# EAGLE design HackJrGameController-v1.0 (EAGLE 6.5.0)
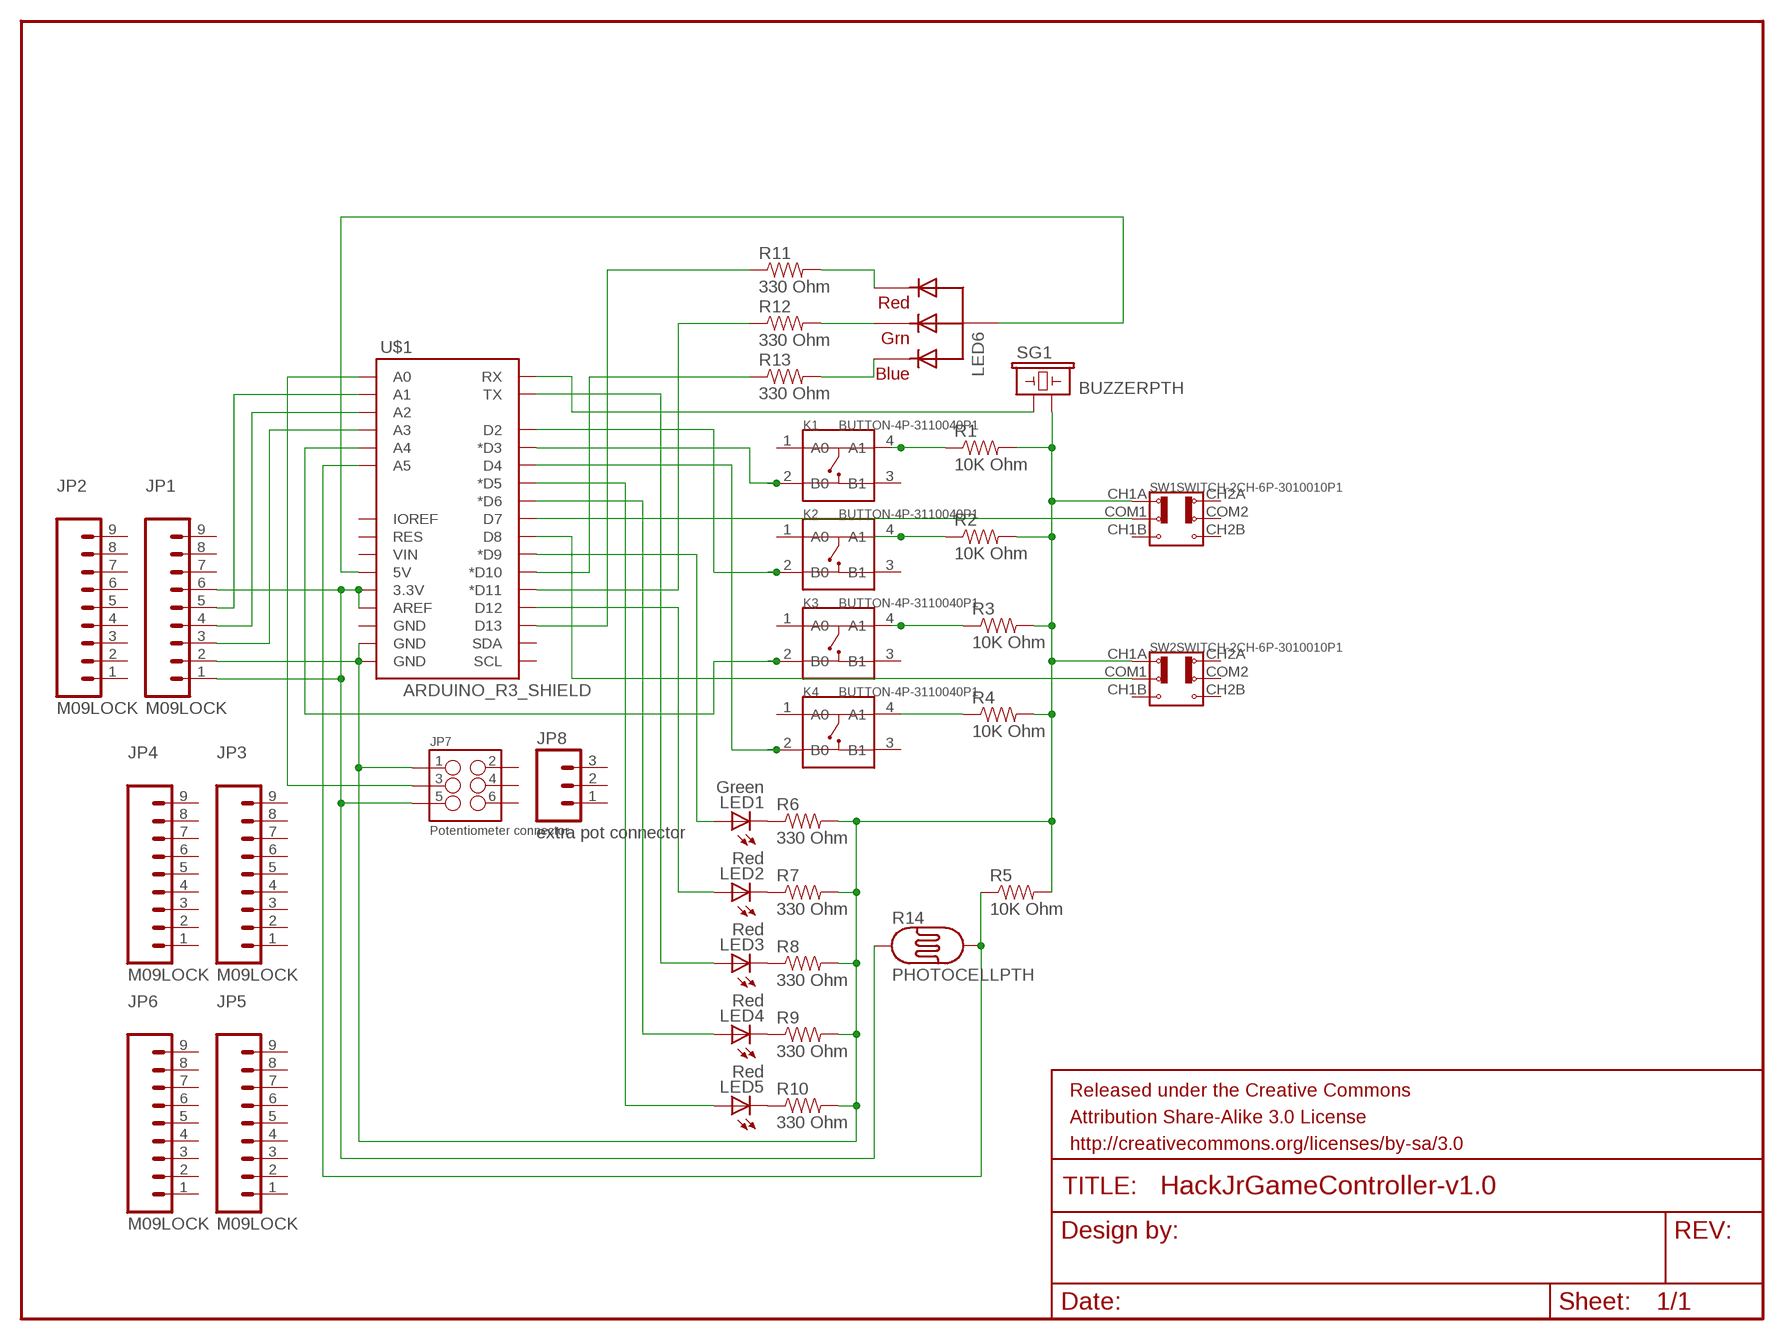
[diagram p0: schematic, sheet 1]

## Parts
FRAME1  FRAME-LETTER  [CREATIVE_COMMONS]
JP1  M09LOCK  [1X09_LOCK]
JP2  M09LOCK  [1X09_LOCK]
JP3  M09LOCK  [1X09_LOCK]
JP4  M09LOCK  [1X09_LOCK]
JP5  M09LOCK  [1X09_LOCK]
JP6  M09LOCK  [1X09_LOCK]
JP7  Potentiometer connector  M03X2NO_SILK  [2X3-NS]
JP8  extra pot connector  M031X03_NO_SILK  [1X03_NO_SILK]
K1  BUTTON-4P-3110040P1  [4P-6.0X6.0X5.0H]
K2  BUTTON-4P-3110040P1  [4P-6.0X6.0X5.0H]
K3  BUTTON-4P-3110040P1  [4P-6.0X6.0X5.0H]
K4  BUTTON-4P-3110040P1  [4P-6.0X6.0X5.0H]
LED1  Green  LED5MM  [LED5MM]
LED2  Red  LED5MM  [LED5MM]
LED3  Red  LED5MM  [LED5MM]
LED4  Red  LED5MM  [LED5MM]
LED5  Red  LED5MM  [LED5MM]
LED6  RGBLED_CA-5MM  [LED5MMRGB]
R1  10K Ohm  10KOHM1/6W5%(PTH)KIT  [AXIAL-0.3-KIT]
R2  10K Ohm  10KOHM1/6W5%(PTH)KIT  [AXIAL-0.3-KIT]
R3  10K Ohm  10KOHM1/6W5%(PTH)KIT  [AXIAL-0.3-KIT]
R4  10K Ohm  10KOHM1/6W5%(PTH)KIT  [AXIAL-0.3-KIT]
R5  10K Ohm  10KOHM1/6W5%(PTH)KIT  [AXIAL-0.3-KIT]
R6  330 Ohm  RESISTORKIT  [AXIAL-0.3-KIT]
R7  330 Ohm  RESISTORKIT  [AXIAL-0.3-KIT]
R8  330 Ohm  RESISTORKIT  [AXIAL-0.3-KIT]
R9  330 Ohm  RESISTORKIT  [AXIAL-0.3-KIT]
R10  330 Ohm  RESISTORKIT  [AXIAL-0.3-KIT]
R11  330 Ohm  RESISTORKIT  [AXIAL-0.3-KIT]
R12  330 Ohm  RESISTORKIT  [AXIAL-0.3-KIT]
R13  330 Ohm  RESISTORKIT  [AXIAL-0.3-KIT]
R14  PHOTOCELLPTH  [PHOTOCELL]
SG1  BUZZERPTH  [BUZZER-12MM]
SW1  SWITCH-2CH-6P-3010010P1  [6P-2CH-2.54-9.1X3.5X3.2+2H]
SW2  SWITCH-2CH-6P-3010010P1  [6P-2CH-2.54-9.1X3.5X3.2+2H]
U$1  ARDUINO_R3_SHIELD  [UNO_R3_SHIELD]

## Nets
N$1: LED6.2(VCC) U$1.5V
N$2: JP1.2 JP7.1 R1.P$2 R2.P$2 R3.P$2 R4.P$2 R5.P$2 R6.P$2 R7.P$2 R8.P$2 R9.P$2 R10.P$2 SG1.- SW1.CH1A SW2.CH1A U$1.GND@0(GND) U$1.GND@1(GND)
N$3: LED6.1(RED) R11.P$2
N$4: LED6.4(BLUE) R13.P$2
N$5: LED6.3(GREEN) R12.P$2
N$6: LED5.K(C) R10.P$1
N$7: LED4.K(C) R9.P$1
N$8: LED3.K(C) R8.P$1
N$9: LED2.K(C) R7.P$1
N$10: LED1.K(C) R6.P$1
N$11: LED1.A U$1.D9(*D9)
N$12: LED2.A U$1.D12
N$13: LED3.A U$1.TX
N$14: LED4.A U$1.D6(*D6)
N$15: LED5.A U$1.D5(*D5)
N$16: R11.P$1 U$1.D13
N$17: R12.P$1 U$1.D11(*D11)
N$18: R13.P$1 U$1.D10(*D10)
N$19: JP1.1 JP1.6 JP7.5 R14.1 U$1.3.3V U$1.AREF
N$20: K4.4(A1) R4.P$1
N$22: K2.2(B0) U$1.D2
N$23: K3.2(B0) U$1.A4
N$24: K4.2(B0) U$1.D4
N$25: K2.4(A1) R2.P$1
N$26: K3.4(A1) R3.P$1
N$27: K1.4(A1) R1.P$1
N$28: SG1.+ U$1.RX
N$29: SW1.COM1 U$1.D7
N$30: SW2.COM1 U$1.D8
N$31: R5.P$1 R14.2 U$1.A5
N$32: JP1.3 U$1.A3
N$33: JP1.4 U$1.A2
N$34: JP7.3 U$1.A0
N$35: JP1.5 U$1.A1
N$40: K1.2(B0) U$1.D3(*D3)
Unconnected: JP1.7 JP1.8 JP1.9 JP2.1 JP2.2 JP2.3 JP2.4 JP2.5 JP2.6 JP2.7 JP2.8 JP2.9 JP3.1 JP3.2 JP3.3 JP3.4 JP3.5 JP3.6 JP3.7 JP3.8 JP3.9 JP4.1 JP4.2 JP4.3 JP4.4 JP4.5 JP4.6 JP4.7 JP4.8 JP4.9 JP5.1 JP5.2 JP5.3 JP5.4 JP5.5 JP5.6 JP5.7 JP5.8 JP5.9 JP6.1 JP6.2 JP6.3 JP6.4 JP6.5 JP6.6 JP6.7 JP6.8 JP6.9 JP7.2 JP7.4 JP7.6 JP8.1 JP8.2 JP8.3 K1.1(A0) K1.3(B1) K2.1(A0) K2.3(B1) K3.1(A0) K3.3(B1) K4.1(A0) K4.3(B1) SW1.CH1B SW1.CH2A SW1.CH2B SW1.COM2 SW2.CH1B SW2.CH2A SW2.CH2B SW2.COM2 U$1.GND@2(GND) U$1.IOREF U$1.RES U$1.SCL U$1.SDA U$1.VIN

## Library data of the parts
FRAME1 = SparkFun-Aesthetics:FRAME-LETTER: Schematic Frame Standard 8.5x11 US Letter frame
JP1-JP6 = SparkFun-Connectors:M09: Header 9 Standard 9-pin 0.1" header. Use with straight break away headers (SKU : PRT-00116), right angle break away headers (PRT-00553), swiss pins (PRT-00743), machine pins (PRT-00117), and female headers (PRT-00115).
JP7 = SparkFun-Connectors:M03X2: 2x3 .1" header. Shrouded, with keying- CONN-10681 SMT- CONN-11415 Pogo pins- HW-11044
JP8 = SparkFun-Connectors:M03: Header 3 Standard 3-pin 0.1" header. Use with straight break away headers (SKU : PRT-00116), right angle break away headers (PRT-00553), swiss pins (PRT-00743), machine pins (PRT-00117), and female headers (PRT-00115). Molex polarized connector foot print use with SKU : PRT-08232 with associated crimp pins and housings.
K1-K4 = OPL Eagle Library:BUTTON-4P
LED1-LED5 = SparkFun-LED:LED: LEDs Standard schematic elements and footprints for 5mm, 3mm, 1206, and 0603 sized LEDs. 5mm - Spark Fun Electronics SKU : COM-00529 (and others)
LED6 = adafruit:RGBLED_CA: RGB LED, common-anode 5MM Staggered pins 5mm Piranha package http://www.ladyada.net/library/pcb/eaglelibrary.html
R1-R5 = SparkFun-Resistors:10KOHM1/6W5%(PTH): RES-08375; PROD_ID: RES-08375
R6-R13 = SparkFun-Resistors:RESISTOR: Resistor Basic schematic elements and footprints for 0603, 1206, and PTH resistors.
R14 = SparkFun-Sensors:PHOTOCELL: CdS photoresistor. This is a low cost way to detect light levels. Resistance decreases with more incoming light. SparkFun SKU: SEN-09088
SG1 = SparkFun-Electromechanical:BUZZER: Buzzer 12mm Spark Fun Electronics SKU : Comp-Buzzer
SW1 SW2 = OPL Eagle Library:SWITCH-2CH-6P*: MS-22D18 G2 ROHS
U$1 = SparkFun-Boards:ARDUINO_R3_SHIELD: Shield form compatible with the Arduino Uno R3.

## Board
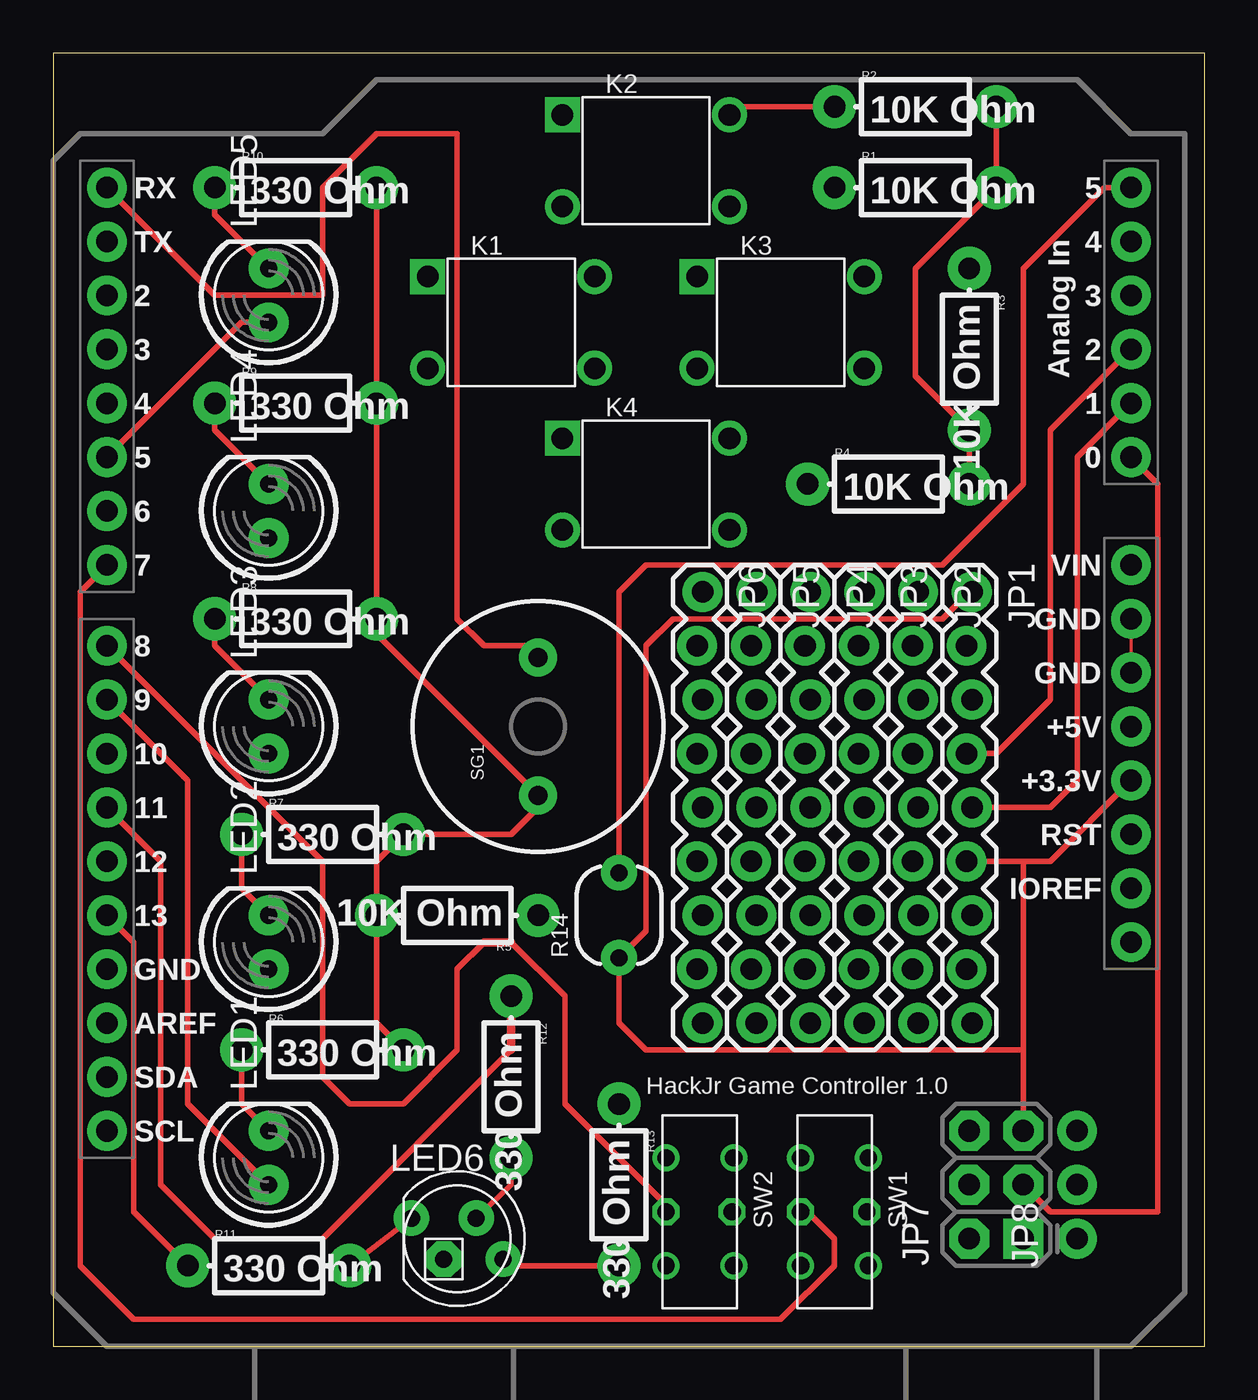
[diagram p1: board, top side]
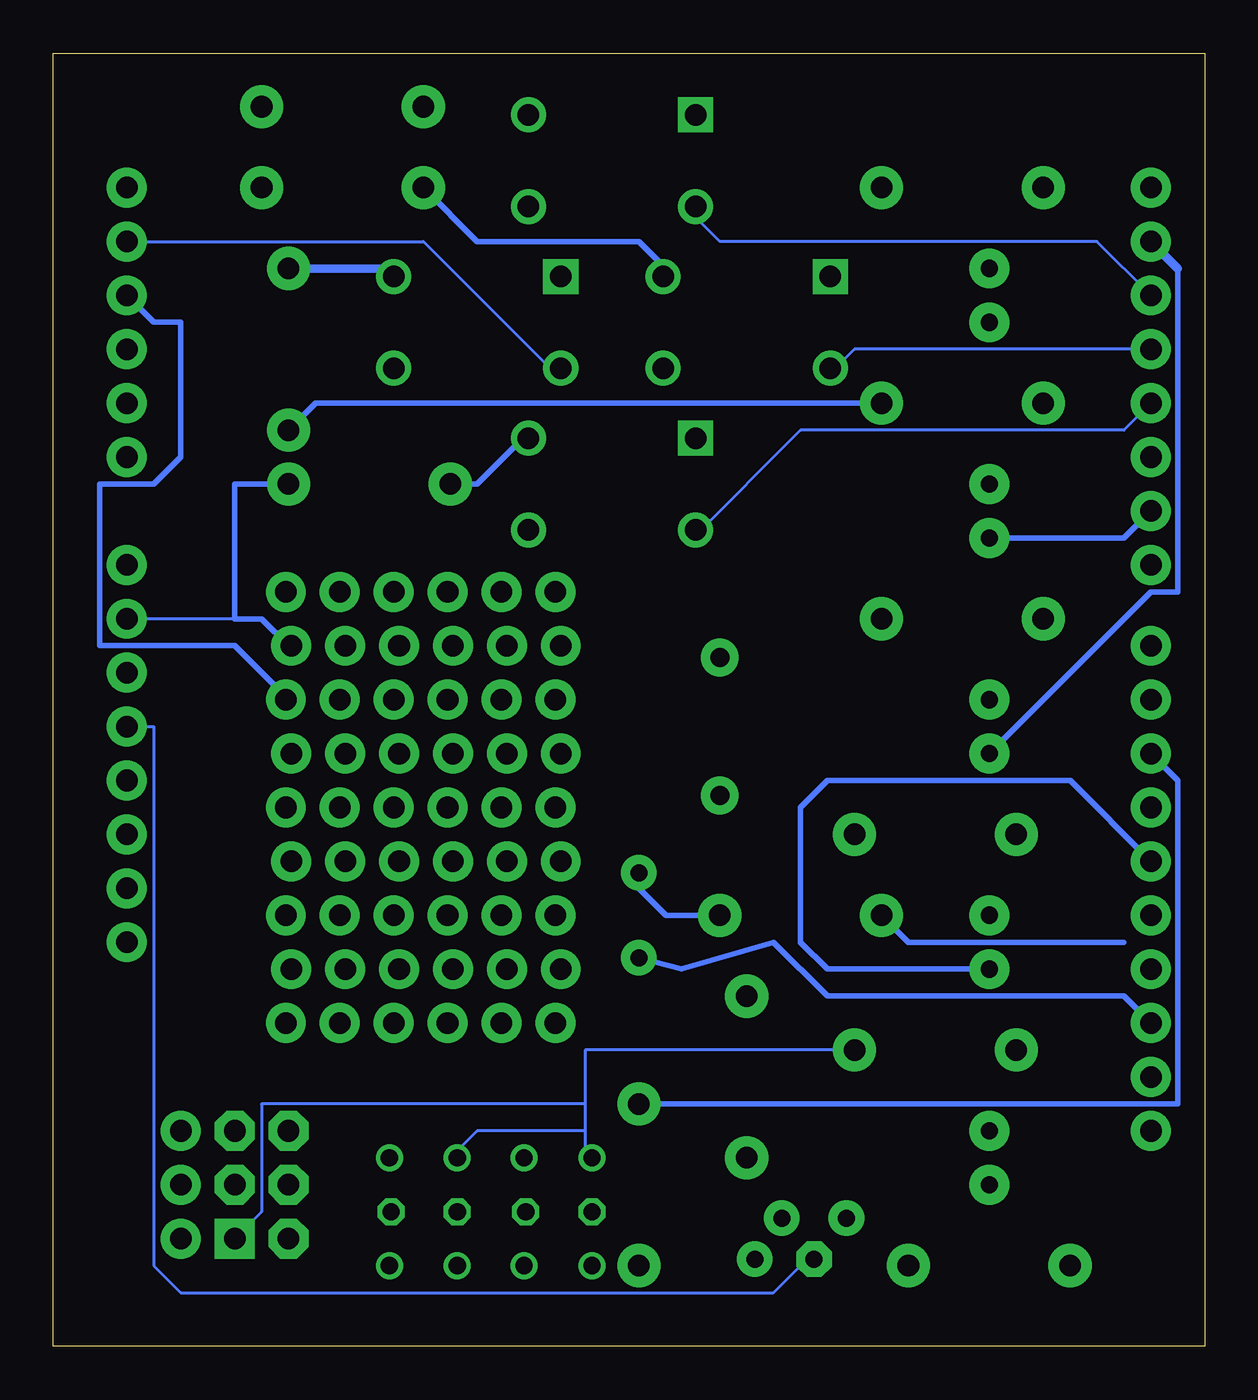
[diagram p2: board, bottom side, seen from below]

Size 54.28 x 60.95 mm. Coordinates in mm from the lower left corner, seen from the top.
Outline: 0,0 54.28,0 54.28,60.95 0,60.95 0,0
Copper layers (1*2*15*16): Top 0.035mm / dielectric 0.2mm / layer 2 0.0175mm / dielectric 1.1mm / layer 15 0.0175mm / dielectric 0.2mm / Bottom 0.035mm
Design rules "SeeedStudio_DRU_no_angle_20130527": minimum track width 6mil, minimum drill 12mil, track to track 6mil, track to pad 6mil, pad to pad 6mil, via to via 6mil, smd to smd 0mil, copper to edge 10mil, drill to drill 10mil, minimum pad ring 6mil, minimum via ring 6mil, stop-mask expansion 2mil, vias tented up to drill 25mil, thermal gap 10mil

### Footprints (pad centres in the part's own frame; a part is rotated, then mirrored left to right if it is on the bottom)
1X09_LOCK = drill 1.016 pad 1.88: 1 0,0.127; 2 2.54,-0.127; 3 5.08,0.127; 4 7.62,-0.127; 5 10.16,0.127; 6 12.7,-0.127; 7 15.24,0.127; 8 17.78,-0.127; 9 20.32,0.127
2X3-NS = drill 1.016 pad 1.88 square: 1 -2.54,-1.27 | drill 1.016 pad 1.88 octagon: 2 -2.54,1.27; 3 0,-1.27; 4 0,1.27; 5 2.54,-1.27; 6 2.54,1.27
1X03_NO_SILK = drill 1.016 pad 1.88: 1 0,0; 2 2.54,0; 3 5.08,0
4P-6.0X6.0X5.0H = drill 1.016 pad 1.651 square: 1 -3.937,2.159 | drill 1.016 pad 1.651: 2 -3.937,-2.159; 3 3.937,-2.159; 4 3.937,2.159
LED5MM = drill 0.813 pad 1.88: A -1.27,0; K 1.27,0
LED5MMRGB = drill 0.8 pad 1.676: 1 -2.159,0.968; 3 0.889,0.968; 4 2.159,-0.968 | drill 0.8 pad 1.676 octagon: 2 -0.635,-0.968
AXIAL-0.3-KIT = drill 1.016 pad 2.032: P$1 -3.81,0; P$2 3.81,0
PHOTOCELL = drill 0.8 pad 1.676: 1 -2,0; 2 2,0
BUZZER-12MM = drill 0.9 pad 1.778: + 3.25,0; - -3.25,0
6P-2CH-2.54-9.1X3.5X3.2+2H = drill 0.813 pad 1.27: CH1A -2.54,-1.6; CH1B 2.54,-1.6; CH2A -2.54,1.6; CH2B 2.54,1.6 | drill 0.813 pad 1.27 octagon: COM1 0,-1.6; COM2 0,1.524
UNO_R3_SHIELD = drill 1.016 pad 1.88: 3.3V 50.8,26.67; 5V 50.8,29.21; A0 50.8,41.91; A1 50.8,44.45; A2 50.8,46.99; A3 50.8,49.53; A4 50.8,52.07; A5 50.8,54.61; AREF 2.54,15.24; D2 2.54,49.53; D3 2.54,46.99; D4 2.54,44.45; D5 2.54,41.91; D6 2.54,39.37; D7 2.54,36.83; D8 2.54,33.02; D9 2.54,30.48; D10 2.54,27.94; D11 2.54,25.4; D12 2.54,22.86; D13 2.54,20.32; GND@0 50.8,31.75; GND@1 50.8,34.29; GND@2 2.54,17.78; IOREF 50.8,21.59; NC 50.8,19.05; RES 50.8,24.13; RX 2.54,54.61; SCL 2.54,10.16; SDA 2.54,12.7; TX 2.54,52.07; VIN 50.8,36.83

### Placement (x,y rotation side)
FRAME1  -5.08,-16.51 0 top  (outside the outline)
JP1  43.18,35.56 270 top
JP2  40.64,35.56 270 top
JP3  38.1,35.56 270 top
JP4  35.56,35.56 270 top
JP5  33.02,35.56 270 top
JP6  30.48,35.56 270 top
JP7  44.45,7.62 90 top
JP8  48.26,5.08 90 top
K1  21.59,48.26 0 top
K2  27.94,55.88 0 top
K3  34.29,48.26 0 top
K4  27.94,40.64 0 top
LED1  10.16,8.89 90 top
LED2  10.16,19.05 90 top
LED3  10.16,29.21 90 top
LED4  10.16,39.37 90 top
LED5  10.16,49.53 90 top
LED6  19.05,5.08 0 top
R1  40.64,54.61 0 top
R2  40.64,58.42 0 top
R3  43.18,46.99 270 top
R4  39.37,40.64 0 top
R5  19.05,20.32 180 top
R6  12.7,13.97 0 top
R7  12.7,24.13 0 top
R8  11.43,34.29 0 top
R9  11.43,44.45 0 top
R10  11.43,54.61 0 top
R11  10.16,3.81 0 top
R12  21.59,12.7 270 top
R13  26.67,7.62 270 top
R14  26.67,20.32 90 top
SG1  22.86,29.21 90 top
SW1  36.83,6.35 270 top
SW2  30.48,6.35 270 top
U$1  0,0 0 top

### Tracks (layer width: path | path; a pad name or v marks a point on that pad's centre or on a via)
N$1
  Bottom 0.152: U$1.5V 49.53,29.21 49.53,3.81 48.26,2.54 20.32,2.54 19.05,3.81 LED6.2
N$2
  Top 0.152: U$1.GND@1 U$1.GND@0
  Top 0.254: R2.P$2 R1.P$2 40.64,50.8 40.64,45.72 R3.P$2 R4.P$2 | R10.P$2 R9.P$2 R8.P$2 15.24,33.58 SG1.- 22.86,25.4 21.59,24.13 R7.P$2 | R7.P$2 17.78,24.13 | R7.P$2 15.24,22.86 R5.P$2 15.24,15.24 R6.P$2
  Bottom 0.152: 29.21,11.43 29.21,13.97 R6.P$2 | 29.21,11.43 29.21,10.16 | 29.21,10.16 29.21,8.89 SW2.CH1A | 29.21,10.16 34.29,10.16 35.56,8.89 SW1.CH1A | JP7.1 44.45,6.35 44.45,11.43 29.21,11.43 | 45.72,34.29 U$1.GND@1
  Bottom 0.254: 3.81,19.05 13.97,19.05 R5.P$2 | R3.P$2 41.91,44.45 R9.P$2 | JP1.2 43.18,33.02 44.45,34.29 45.72,34.29 45.72,40.64 R4.P$2
N$3
  Top 0.254: R11.P$2 LED6.1
N$4
  Top 0.254: LED6.4 21.59,3.81 R13.P$2
N$5
  Top 0.254: LED6.3 21.59,7.62 R12.P$2
N$6
  Top 0.254: LED5.K 7.62,53.34 R10.P$1
N$7
  Top 0.254: LED4.K 7.62,43.18 R9.P$1
N$8
  Top 0.254: LED3.K 7.62,33.02 R8.P$1
N$9
  Top 0.254: R7.P$1 8.89,21.59 LED2.K
N$10
  Top 0.254: R6.P$1 8.89,11.43 LED1.K
N$11
  Top 0.254: LED1.A 6.35,11.43 6.35,26.67 U$1.D9
N$12
  Bottom 0.254: U$1.D12 6.35,26.67 17.78,26.67 19.05,25.4 19.05,19.05 17.78,17.78 LED2.A
N$13
  Bottom 0.254: LED3.A 2.54,35.56 1.27,35.56 1.27,50.8
  Bottom 0.406: U$1.TX 1.27,50.8
N$14
  Bottom 0.254: U$1.D6 3.81,38.1 LED4.A
N$15
  Top 0.254: U$1.D5 8.89,48.26 LED5.A
N$16
  Top 0.254: U$1.D13 3.81,19.05 3.81,6.35 R11.P$1
N$17
  Top 0.254: U$1.D11 5.08,22.86 5.08,7.62 7.62,5.08 12.7,5.08 21.59,13.97
  Top 0.406: R12.P$1 21.59,13.97
N$18
  Bottom 0.254: U$1.D10 1.27,26.67 1.27,11.43 R13.P$1
N$19
  Top 0.254: 45.72,13.97 27.94,13.97 26.67,15.24 R14.1 27.94,19.59 27.94,33.02 29.21,34.29 41.91,34.29 43.18,35.56 JP1.1 | 45.72,13.97 JP7.5 | 45.72,13.97 45.72,22.86 JP1.6 46.99,22.86 U$1.3.3V
  Bottom 0.254: U$1.AREF 3.81,16.51 17.78,16.51 20.32,19.05 24.67,17.78 R14.1
N$20
  Bottom 0.254: R4.P$1 34.29,40.64 31.75,43.18 K4.4
N$22
  Bottom 0.152: U$1.D2 5.08,52.07 22.86,52.07 24.13,53.34 K2.2
N$23
  Bottom 0.152: U$1.A4 36.83,52.07 30.48,45.72 K3.2
N$24
  Bottom 0.152: U$1.D4 3.81,43.18 19.05,43.18 24.13,38.1 K4.2
N$25
  Top 0.254: R2.P$1 31.75,58.42 K2.4
N$26
  Top 0.254: 38.1,50.8 K3.4
  Bottom 0.406: R3.P$1 38.61,50.8 K3.4
N$27
  Bottom 0.254: R1.P$1 34.29,52.07 26.67,52.07 25.4,50.8 K1.4
N$28
  Top 0.254: U$1.RX 7.62,49.53 12.7,49.53 12.7,54.61 15.24,57.15 19.05,57.15 19.05,34.29 20.32,33.02 22.3,33.02 SG1.+
N$29
  Top 0.152: 35.56,6.35 SW1.COM1
  Top 0.254: 35.56,6.35 36.83,5.08 36.83,3.81 34.29,1.27 3.81,1.27 1.27,3.81 1.27,35.56 U$1.D7
N$30
  Top 0.254: U$1.D8 12.7,22.86 12.7,12.7 13.97,11.43 16.51,11.43 19.05,13.97 19.05,17.78 20.32,19.05 | 21.59,19.05 24.13,16.51 24.13,11.43 28.88,6.68
  Top 0.406: 20.32,19.05 21.59,19.05 | SW2.COM1 28.88,6.68
N$31
  Top 0.254: U$1.A5 49.53,54.61 45.72,50.8 45.72,40.64 41.91,36.83 27.94,36.83 26.67,35.56 R14.2
  Bottom 0.254: R5.P$1 25.4,20.32 26.67,21.59 R14.2
N$32
  Bottom 0.254: U$1.A3 49.53,48.26 48.26,48.26 48.26,41.91 49.53,40.64 52.07,40.64 52.07,33.02 45.72,33.02 43.18,30.48 JP1.3
N$33
  Top 0.254: U$1.A2 46.99,43.18 46.99,30.48 44.45,27.94 JP1.4
N$34
  Top 0.254: U$1.A0 52.07,40.64 52.07,6.35 46.99,6.35 JP7.3
N$35
  Top 0.254: U$1.A1 48.26,41.91 48.26,26.67 46.99,25.4 JP1.5
  Bottom 0.254: 43.18,25.4 JP1.5
N$40
  Bottom 0.152: U$1.D3 16.51,46.99 17.78,45.72 K1.2

### Text on the board
tNames: HackJr Game Controller 1.0